# Altium schematic sheet Interfaces.SchDoc
size B; DocumentNumber: 2; Revision: 3.0; SheetNumber: 2; SheetTotal: 3
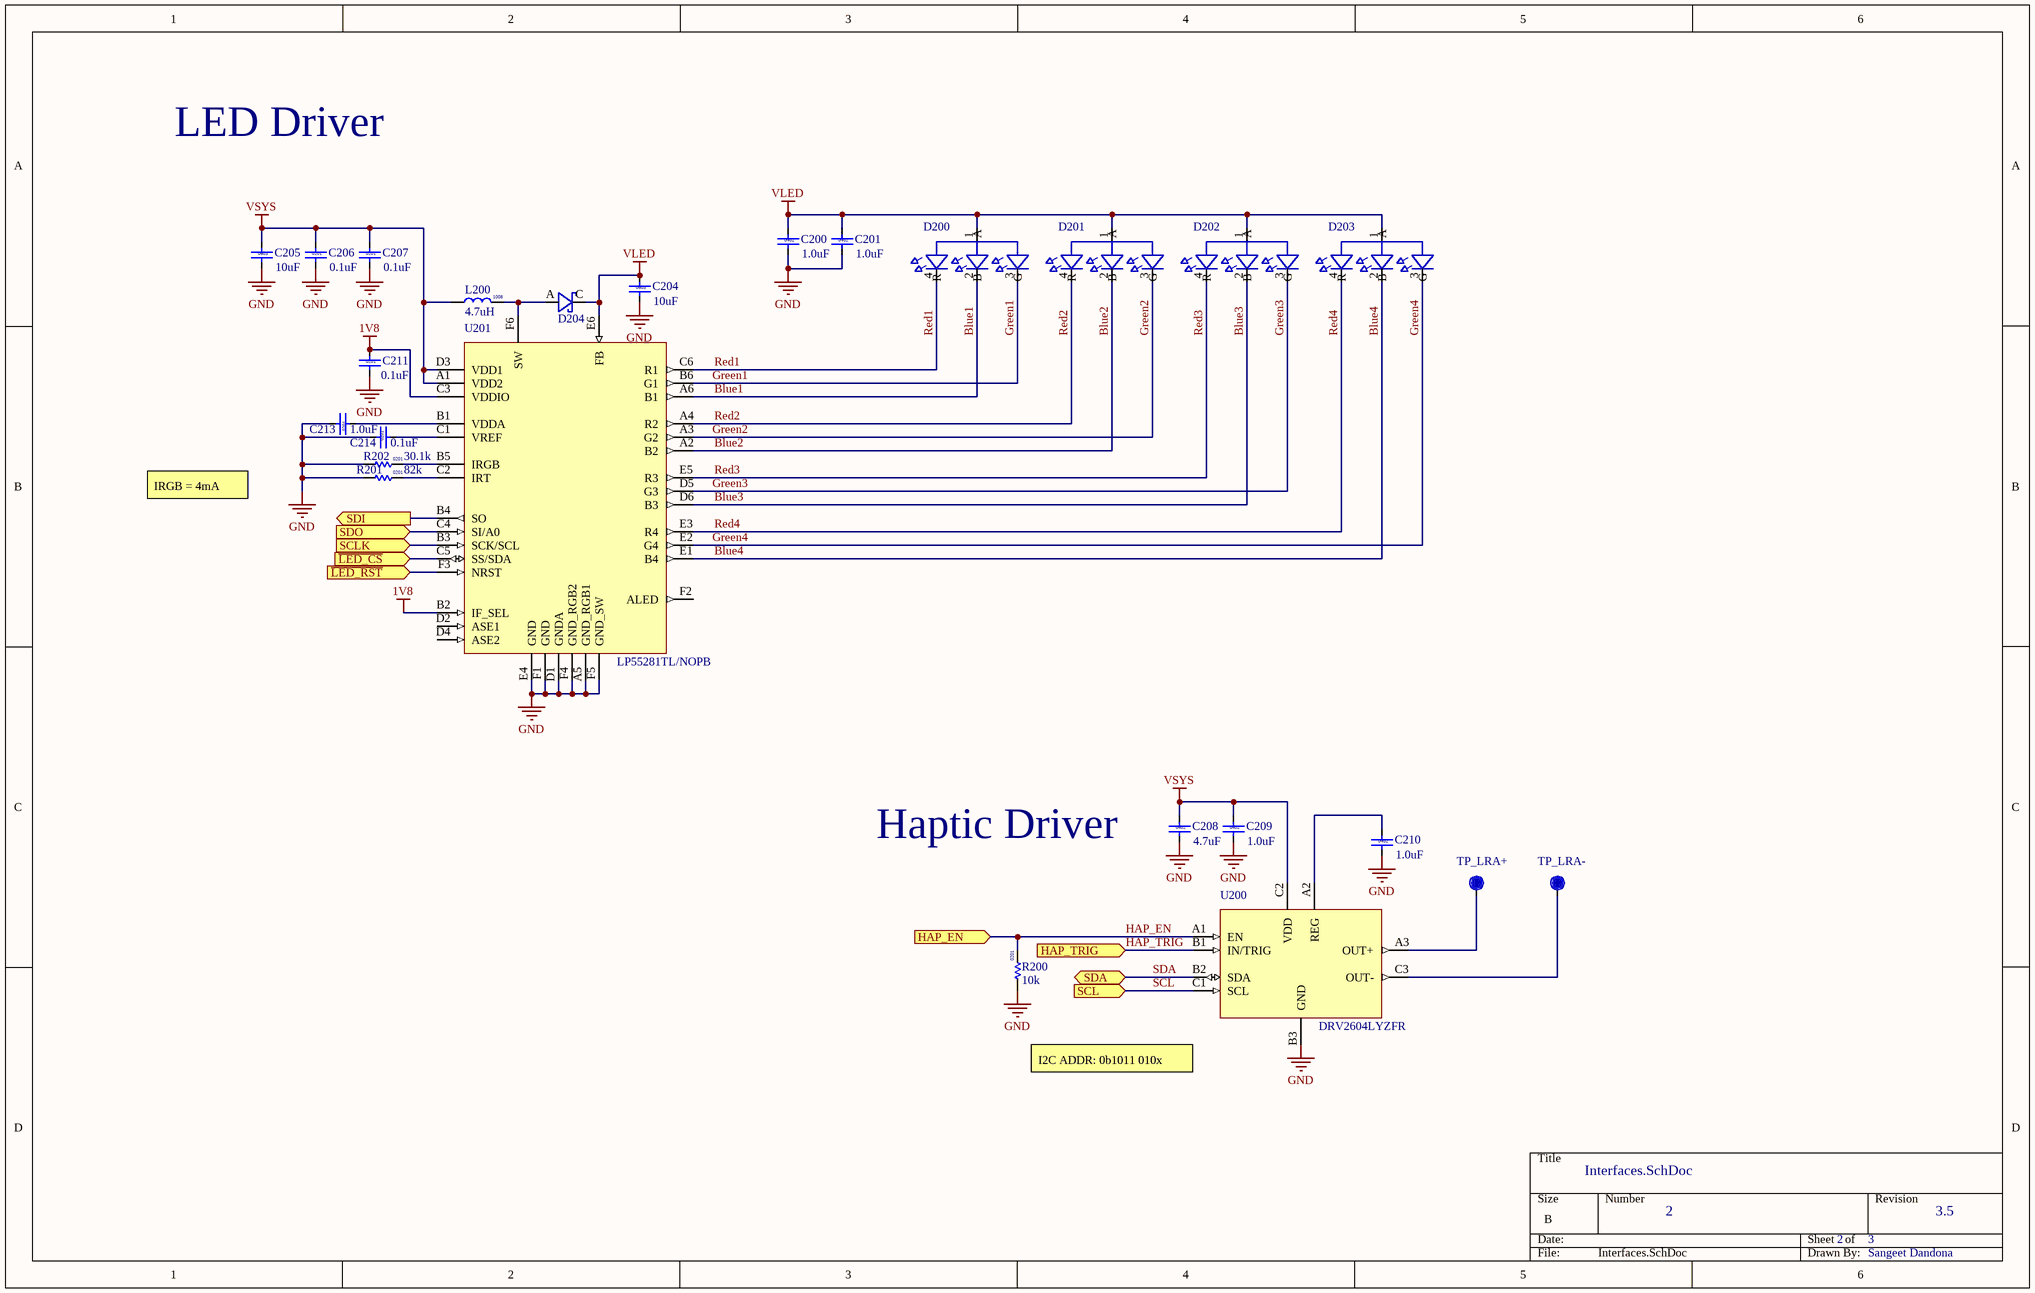
[diagram p0: Interfaces.SchDoc]

## Parts
C200  value 1.0uF  Size: 0402  [Cap 0402 HD]
C201  value 1.0uF  Size: 0402  [Cap 0402 HD]
C204  value 10uF  Size: 0603  [Cap 0603]
C205  value 10uF  Size: 0603  [Cap 0603]
C206  value 0.1uF  Size: 0201  [Cap 0201 HD]
C207  value 0.1uF  Size: 0201  [Cap 0201 HD]
C208  value 4.7uF  Size: 0402  [Cap 0402 HD]
C209  value 1.0uF  Size: 0402  [Cap 0402 HD]
C210  value 1.0uF  Size: 0402  [Cap 0402 HD]
C211  value 0.1uF  Size: 0201  [Cap 0201 HD]
C213  value 1.0uF  Size: 0201  [Cap 0201 HD]
C214  value 0.1uF  Size: 0201  [Cap 0201 HD]
D200  (no value)  [4-PLCC]
D201  (no value)  [4-PLCC]
D202  (no value)  [4-PLCC]
D203  (no value)  [4-PLCC]
D204  (no value)  [SOD-123F_U]
L200  value 4.7uH  Size: 1008  [IND 1008]
R200  value 10k  Size: 0201  [RES 0201 HD]
R201  value 82k  Size: 0201  [RES 0201 HD]
R202  value 30.1k  Size: 0201  [RES 0201 HD]
TP_LRA+  TP  [TP17R]  (value not drawn)
TP_LRA-  TP  [TP17R]  (value not drawn)
U200  MFPN: DRV2604LYZFR  [BGA0.5P3x3-9Pin]
U201  MFPN: LP55281TL/NOPB  [BGA0.5P6x6-36Pin]

## Ports
HAP_EN (in), HAP_TRIG (in), SCL (in), SCLK (in), SDA (bidir), SDI (out), SDO (in), ~{LED_CS} (in), ~{LED_RST} (in)

## Nets
1V8: C211.1 U201.B2(IF_SEL) U201.C3(VDDIO)
GND: C200.2 C201.2 C204.2 C205.2 C206.2 C207.2 C208.2 C209.2 C210.2 C211.2 C213.2 C214.1 R200.1 R201.1 R202.1 U200.B3(GND) U201.A5(GND_RGB1) U201.D1(GNDA) U201.E4(GND) U201.F1(GND) U201.F4(GND_RGB2) U201.F5(GND_SW)
VLED: C200.1 C201.1 C204.1 D200.1(A) D201.1(A) D202.1(A) D203.1(A) D204.C U201.E6(FB)
VSYS: C205.1 C206.1 C207.1 C208.1 C209.1 L200.1 U200.C2(VDD) U201.A1(VDD2) U201.D3(VDD1)
~{LED_CS}: U201.C5(SS/SDA) ; port ~{LED_CS}
~{LED_RST}: U201.F3(NRST) ; port ~{LED_RST}
Blue1: D200.2(B) U201.A6(B1)
Blue2: D201.2(B) U201.A2(B2)
Blue3: D202.2(B) U201.D6(B3)
Blue4: D203.2(B) U201.E1(B4)
Green1: D200.3(G) U201.B6(G1)
Green2: D201.3(G) U201.A3(G2)
Green3: D202.3(G) U201.D5(G3)
Green4: D203.3(G) U201.E2(G4)
HAP_EN: R200.2 U200.A1(EN) ; port HAP_EN
HAP_TRIG: U200.B1(IN/TRIG) ; port HAP_TRIG
Red1: D200.4(R) U201.C6(R1)
Red2: D201.4(R) U201.A4(R2)
Red3: D202.4(R) U201.E5(R3)
Red4: D203.4(R) U201.E3(R4)
SCL: U200.C1(SCL) ; port SCL
SCLK: U201.B3(SCK/SCL) ; port SCLK
SDA: U200.B2(SDA) ; port SDA
SDI: U201.B4(SO) ; port SDI
SDO: U201.C4(SI/A0) ; port SDO
NetC210_1: C210.1 U200.A2(REG)
NetC213_1: C213.1 U201.B1(VDDA)
NetC214_2: C214.2 U201.C1(VREF)
NetD204_A: D204.A L200.2 U201.F6(SW)
NetR201_2: R201.2 U201.C2(IRT)
NetR202_2: R202.2 U201.B5(IRGB)
NetTP_LRA+_1: TP_LRA+.1 U200.A3(OUT+)
NetTP_LRA-_1: TP_LRA-.1 U200.C3(OUT-)

Not connected (* = marked no-connect by the designer): U201 D2(ASE1) D4(ASE2) F2(ALED)

## Notes on the sheet
- LED Driver
- IRGB = 4mA
- (near C208) Haptic Driver
- (near U200) I2C ADDR: 0b1011 010x
- 3.5
- Sangeet Dandona

## Library data of the parts
C200 C201 C209 = Cap 0402 1.0uF 10V: CAP CER 1UF 10V 10% X5R 0402; MF: Murata Electronics North America; MFPN: GRM155R61A105KE15D; Cost: 0.00990
C204 C205 = Cap 0603 10uF 10V: CAP CER 10UF 10V 20% X5R 0603; MF: TDK Corporation; MFPN: C1608X5R1A106M080AC; Cost: 0.12650
C206 C207 C211 C214 = Cap 0201 0.1uF 6.3V: CAP CER 0.1UF 6.3V 10% X5R 0201; MF: Murata Electronics North America; MFPN: GRM033R60J104KE19D; Cost: 0.00780
C208 = Cap 0402 4.7uF 10V: CAP CER 4.7UF 10V 20% X5R 0402; MF: Samsung Electro-Mechanics America, Inc.; MFPN: CL05A475MP5NRNC; Cost: 0.11730
C210 = Cap 0402 1.0uF 10V: CAP CER 1UF 10V 10% X5R 0402; MFPN: GRM155R61A105KE15D; MF: Murata Electronics North America; Cost: 0.00990
C213 = Cap 0201 1.0uF 6.3V: CAP CER 1UF 6.3V 20% X5R 0201; MF: Samsung Electro-Mechanics America, Inc.; MFPN: CL03A105MQ3CSNC; Cost: 0.27950
D200-D203 = CLMVB-FKA-CFHEHLCBB7A363: LED RGB 3-IN-1 SMD 4PLCC; MF: Cree Inc.; Size: 2.1mm x 2.1mm; Package: 4-PLCC; Cost: 2.68; MFPN: CLMVB-FKA-CFHEHLCBB7A363
D204 = MBR120VLSFT3G: DIODE SCHOTTKY 20V 1A SOD123FL; MF: ON Semiconductor; Size: 3.8mm x 1.8mm; Package: SOD-123F; Type: Schottky; Cost: 0.11660; MFPN: MBR120VLSFT3G
L200 = Ind 1008 4.7uH 650mA: FIXED IND 4.7UH 1A 250 MOHM SMD; MF: Samsung Electro-Mechanics America, Inc.; MFPN: CIG22B4R7MNE; Cost: 0.08498
R200 = Res 0201 10k 5%: RES SMD 10K OHM 5% 1/20W 0201; MF: Rohm Semiconductor; MFPN: MCR006YRTJ103; Cost: 0.00828
R201 = Res 0201 Generic: RES SMD 82K OHM 1% 1/20W 0201; MF: Panasonic Electronic Components; MFPN: ERJ-1GEF8202C; Cost: 0.01049
R202 = Res 0201 Generic: RES SMD 30.1K OHM 1% 1/20W 0201; MF: Panasonic Electronic Components; MFPN: ERJ-1GEF3012C; Cost: 0.01049
TP_LRA+ TP_LRA- = TP17R: Testpoint, Round 1.7mm Dia; MFPN: DNP; Size: 1.7mm; Cost: 0; MF: N/A
U200 = DRV2604L: IC ERM/LRA HAPTIC DRIVER 9DSBGA; MF: Texas Instruments; Size: 1.47mm x 1.47mm; Cost: 1.35000
U201 = LP55281TL: IC LED DRIVER RGLTR DIM 36USMD; MF: Texas Instruments; Size: 3.013mm x 3.013mm; Cost: 1.17000